# Altium schematic sheet MercurialSDR_BlockSheet.SchDoc
size A4
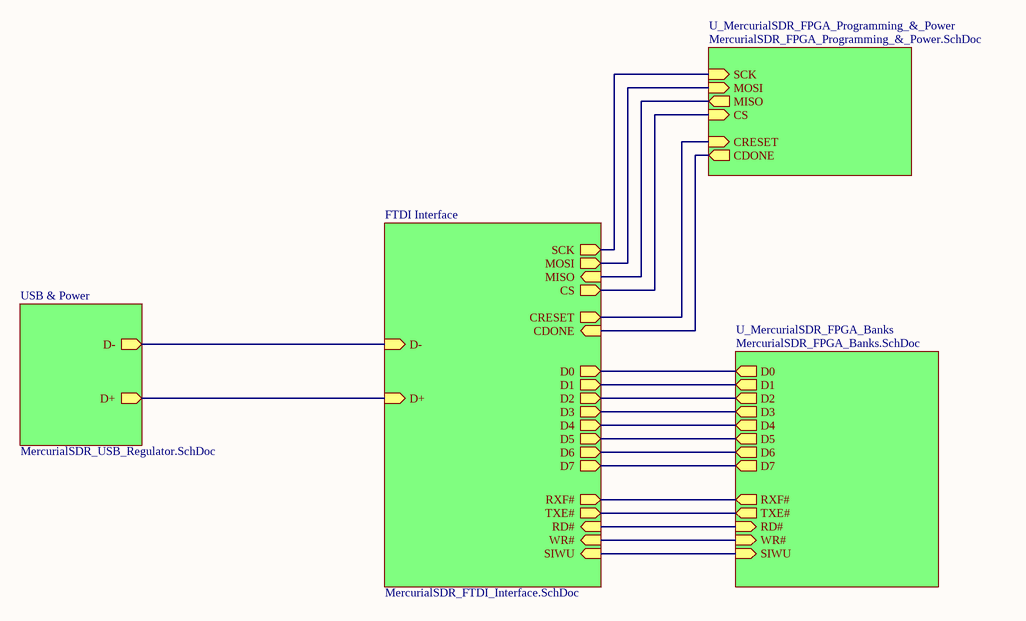
[diagram p0: MercurialSDR_BlockSheet.SchDoc]

## Sub-sheets
FTDI Interface = MercurialSDR_FTDI_Interface.SchDoc: D- (in), D+ (in), SCK (out), MOSI (out), MISO (in), CS (out), CDONE (in), CRESET (out), D0 (out), D1 (out), D2 (out), D3 (out), D4 (out), D5 (out), D6 (out), D7 (out), RXF# (out), TXE# (out), RD# (in), WR# (in), SIWU (in)
U_MercurialSDR_FPGA_Banks = MercurialSDR_FPGA_Banks.SchDoc: D0 (out), D1 (out), D2 (out), D3 (out), D4 (out), D5 (out), D6 (out), D7 (out), RXF# (out), TXE# (out), RD# (in), WR# (in), SIWU (in)
U_MercurialSDR_FPGA_Programming_&_Power = MercurialSDR_FPGA_Programming_&_Power.SchDoc: CRESET (in), CDONE (out), CS (in), SCK (in), MOSI (in), MISO (out)
USB & Power = MercurialSDR_USB_Regulator.SchDoc: D+ (out), D- (out)

## Nets
(unnamed): sheet U_MercurialSDR_FPGA_Banks/D0, sheet FTDI Interface/D0
(unnamed): sheet U_MercurialSDR_FPGA_Banks/D1, sheet FTDI Interface/D1
(unnamed): sheet U_MercurialSDR_FPGA_Banks/D2, sheet FTDI Interface/D2
(unnamed): sheet U_MercurialSDR_FPGA_Banks/D3, sheet FTDI Interface/D3
(unnamed): sheet U_MercurialSDR_FPGA_Banks/D4, sheet FTDI Interface/D4
(unnamed): sheet U_MercurialSDR_FPGA_Banks/D5, sheet FTDI Interface/D5
(unnamed): sheet U_MercurialSDR_FPGA_Banks/D6, sheet FTDI Interface/D6
(unnamed): sheet U_MercurialSDR_FPGA_Banks/D7, sheet FTDI Interface/D7
(unnamed): sheet U_MercurialSDR_FPGA_Banks/RXF#, sheet FTDI Interface/RXF#
(unnamed): sheet U_MercurialSDR_FPGA_Banks/TXE#, sheet FTDI Interface/TXE#
(unnamed): sheet U_MercurialSDR_FPGA_Banks/RD#, sheet FTDI Interface/RD#
(unnamed): sheet U_MercurialSDR_FPGA_Banks/WR#, sheet FTDI Interface/WR#
(unnamed): sheet U_MercurialSDR_FPGA_Banks/SIWU, sheet FTDI Interface/SIWU
(unnamed): sheet U_MercurialSDR_FPGA_Programming_&_Power/CRESET, sheet FTDI Interface/CRESET
(unnamed): sheet U_MercurialSDR_FPGA_Programming_&_Power/CDONE, sheet FTDI Interface/CDONE
(unnamed): sheet U_MercurialSDR_FPGA_Programming_&_Power/CS, sheet FTDI Interface/CS
(unnamed): sheet U_MercurialSDR_FPGA_Programming_&_Power/SCK, sheet FTDI Interface/SCK
(unnamed): sheet U_MercurialSDR_FPGA_Programming_&_Power/MOSI, sheet FTDI Interface/MOSI
(unnamed): sheet U_MercurialSDR_FPGA_Programming_&_Power/MISO, sheet FTDI Interface/MISO
(unnamed): sheet FTDI Interface/D-, sheet USB & Power/D-
(unnamed): sheet FTDI Interface/D+, sheet USB & Power/D+